# EAGLE design cropdroid-irrigation (EAGLE 9.7.0)
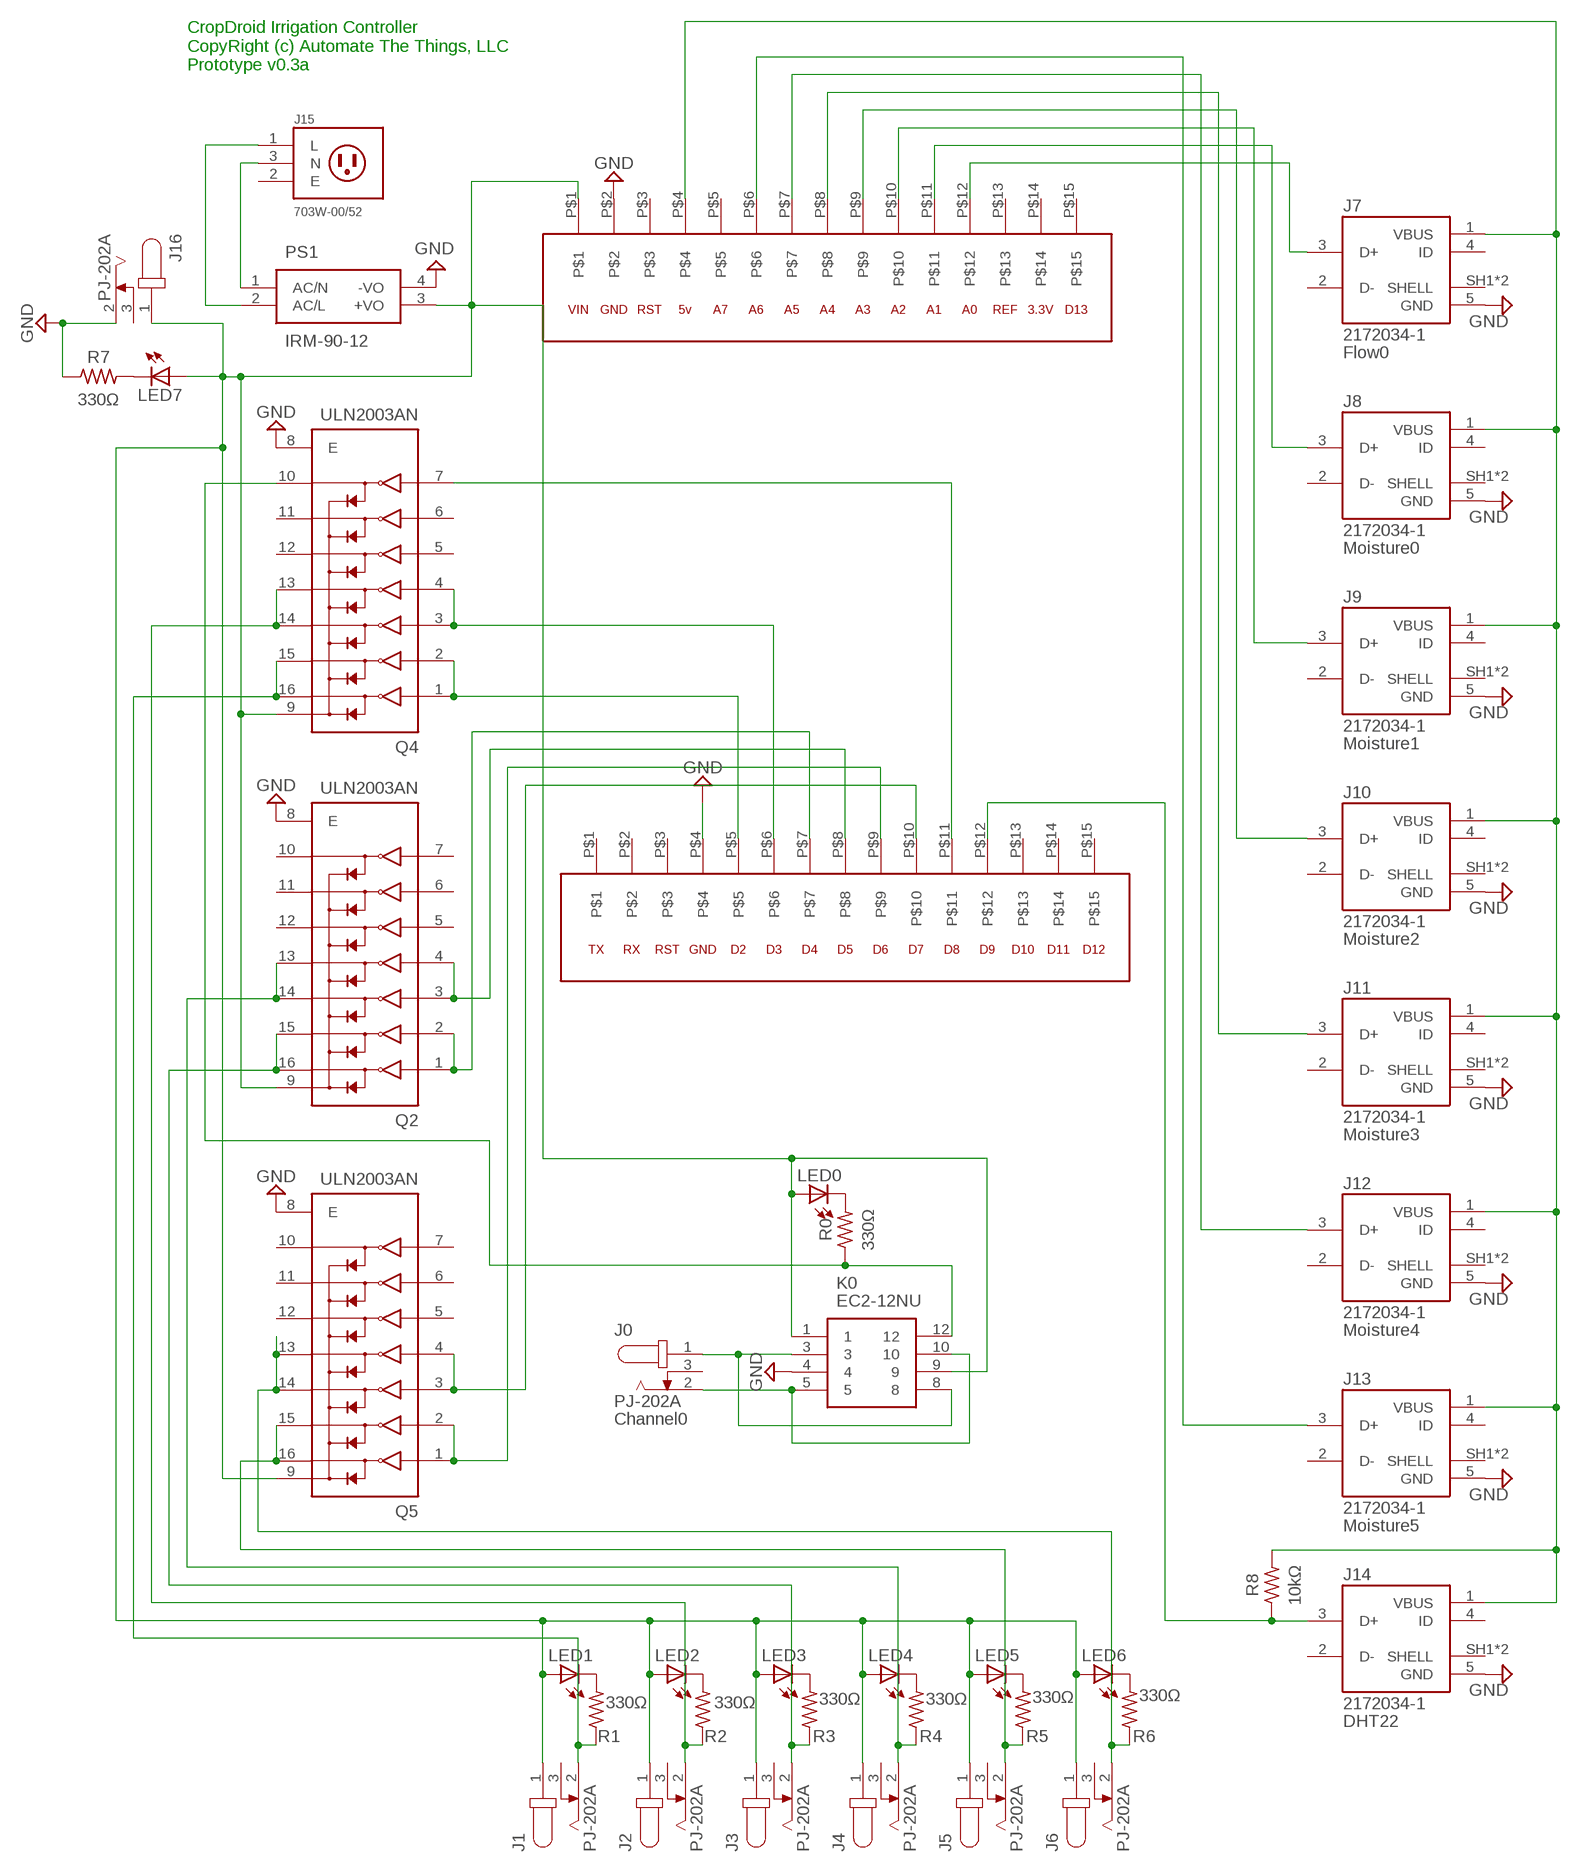
[diagram p0: schematic, sheet 1]

## Parts
J0  PJ-202A  [CUI_PJ-202A]
J1  PJ-202A  [CUI_PJ-202A]
J2  PJ-202A  [CUI_PJ-202A]
J3  PJ-202A  [CUI_PJ-202A]
J4  PJ-202A  [CUI_PJ-202A]
J5  PJ-202A  [CUI_PJ-202A]
J6  PJ-202A  [CUI_PJ-202A]
J7  2172034-1  [TE_2172034-1]
J8  2172034-1  [TE_2172034-1]
J9  2172034-1  [TE_2172034-1]
J10  2172034-1  [TE_2172034-1]
J11  2172034-1  [TE_2172034-1]
J12  2172034-1  [TE_2172034-1]
J13  2172034-1  [TE_2172034-1]
J14  2172034-1  [TE_2172034-1]
J15  703W-00/52  [QUALTEK_703W-00/52]
J16  PJ-202A  [CUI_PJ-202A]
K0  EC2-12NU  [EC2-12NU]
LED0  LED3MM  [LED3MM]
LED1  LED3MM  [LED3MM]
LED2  LED3MM  [LED3MM]
LED3  LED3MM  [LED3MM]
LED4  LED3MM  [LED3MM]
LED5  LED3MM  [LED3MM]
LED6  LED3MM  [LED3MM]
LED7  LED3MM  [LED3MM]
PS1  IRM-90-12  [IRM9012]
Q2  ULN2003AN  [DIP794W45P254L1969H508Q16]
Q4  ULN2003AN  [DIP794W45P254L1969H508Q16]
Q5  ULN2003AN  [DIP794W45P254L1969H508Q16]
R0  330Ω  R-US_AXIAL-7.2MM-PITCH  [RESAD724W46L381D178B]
R1  330Ω  R-US_AXIAL-7.2MM-PITCH  [RESAD724W46L381D178B]
R2  330Ω  R-US_AXIAL-7.2MM-PITCH  [RESAD724W46L381D178B]
R3  330Ω  R-US_AXIAL-7.2MM-PITCH  [RESAD724W46L381D178B]
R4  330Ω  R-US_AXIAL-7.2MM-PITCH  [RESAD724W46L381D178B]
R5  330Ω  R-US_AXIAL-7.2MM-PITCH  [RESAD724W46L381D178B]
R6  330Ω  R-US_AXIAL-7.2MM-PITCH  [RESAD724W46L381D178B]
R7  330Ω  R-US_AXIAL-7.2MM-PITCH  [RESAD724W46L381D178B]
R8  10kΩ  R-US_AXIAL-7.2MM-PITCH  [RESAD724W46L381D178B]
U$1  PPTC151LFBN-RC  [PPTC151LFBN-RC]
U$2  PPTC151LFBN-RC  [PPTC151LFBN-RC]

## Nets
GND: J7.5(GND) J8.5(GND) J9.5(GND) J10.5(GND) J11.5(GND) J12.5(GND) J13.5(GND) J14.5(GND) J16.2 K0.4 PS1.4(-VO) Q2.8(E) Q4.8(E) Q5.8(E) R7.1 U$1.P$2 U$2.P$4
N$1: J13.3(D+) U$1.P$6
N$2: K0.12 Q4.10(7C) R0.1
N$3: Q4.1(1B) Q4.2(2B) U$2.P$5
N$4: Q4.3(3B) Q4.4(4B) U$2.P$6
N$5: Q2.1(1B) Q2.2(2B) U$2.P$7
N$6: Q2.3(3B) Q2.4(4B) U$2.P$8
N$7: Q5.1(1B) Q5.2(2B) U$2.P$9
N$8 [PowerSupply]: J1.1 J2.1 J3.1 J4.1 J5.1 J6.1 J16.1 K0.1 K0.9 LED0.A LED1.A LED2.A LED3.A LED4.A LED5.A LED6.A LED7.A PS1.3(+VO) Q2.9(COM) Q4.9(COM) Q5.9(COM) U$1.P$1
N$9: Q4.7(7B) U$2.P$11
N$10: J7.1(VBUS) J8.1(VBUS) J9.1(VBUS) J10.1(VBUS) J11.1(VBUS) J12.1(VBUS) J13.1(VBUS) J14.1(VBUS) R8.2 U$1.P$4
N$11: LED7.K(C) R7.2
N$12: J14.3(D+) R8.1 U$2.P$12
N$13: J0.1 K0.3 K0.8
N$14: J8.3(D+) U$1.P$11
N$15: J0.2 K0.5 K0.10
N$16: J9.3(D+) U$1.P$10
N$17: J10.3(D+) U$1.P$9
N$18: J11.3(D+) U$1.P$8
N$19: J12.3(D+) U$1.P$7
N$20: Q5.3(3B) Q5.4(4B) U$2.P$10
N$21: J7.3(D+) U$1.P$12
N$23 [PowerSupply]: J15.1(L) PS1.2(AC/L)
N$24: LED1.K(C) R1.2
N$25: LED2.K(C) R2.2
N$26 [PowerSupply]: J15.3(N) PS1.1(AC/N)
N$28: LED3.K(C) R3.2
N$37: J1.2 Q4.15(2C) Q4.16(1C) R1.1
N$41: LED4.K(C) R4.2
N$42: LED0.K(C) R0.2
N$45: LED5.K(C) R5.2
N$46: LED6.K(C) R6.2
N$48: J2.2 Q4.13(4C) Q4.14(3C) R2.1
N$51: J3.2 Q2.15(2C) Q2.16(1C) R3.1
N$52: J4.2 Q2.13(4C) Q2.14(3C) R4.1
N$55: J5.2 Q5.15(2C) Q5.16(1C) R5.1
N$56: J6.2 Q5.13(4C) Q5.14(3C) R6.1
Unconnected: J0.3 J1.3 J2.3 J3.3 J4.3 J5.3 J6.3 J7.2(D-) J7.4(ID) J8.2(D-) J8.4(ID) J9.2(D-) J9.4(ID) J10.2(D-) J10.4(ID) J11.2(D-) J11.4(ID) J12.2(D-) J12.4(ID) J13.2(D-) J13.4(ID) J14.2(D-) J14.4(ID) J16.3 Q2.5(5B) Q2.6(6B) Q2.7(7B) Q2.10(7C) Q2.11(6C) Q2.12(5C) Q4.5(5B) Q4.6(6B) Q4.11(6C) Q4.12(5C) Q5.5(5B) Q5.6(6B) Q5.7(7B) Q5.10(7C) Q5.11(6C) Q5.12(5C) U$1.P$3 U$1.P$5 U$1.P$13 U$1.P$14 U$1.P$15 U$2.P$1 U$2.P$2 U$2.P$3 U$2.P$13 U$2.P$14 U$2.P$15

## Notes on the sheet
- CropDroid Irrigation Controller
  CopyRight (c) Automate The Things, LLC
  Prototype v0.3a
- VIN | GND | RST | 5v | A7 | A6 | A5 | A4 | A3 | A2 | A1 | A0 | REF | 3.3V | D13
- Flow0
- Moisture0
- Moisture1
- TX | RX | RST | GND | D2 | D3 | D4 | D5 | D6 | D7 | D8 | D9 | D10 | D11 | D12 | Moisture2
- Moisture3
- Moisture4
- Channel0
- Moisture5
- DHT22

## Power pins joined to a net without a drawn wire
E: J15.2(E)
SHELL: J7.SH1(SHELL) J7.SH2(SHELL) J8.SH1(SHELL) J8.SH2(SHELL) J9.SH1(SHELL) J9.SH2(SHELL) J10.SH1(SHELL) J10.SH2(SHELL) J11.SH1(SHELL) J11.SH2(SHELL) J12.SH1(SHELL) J12.SH2(SHELL) J13.SH1(SHELL) J13.SH2(SHELL) J14.SH1(SHELL) J14.SH2(SHELL)

## Library data of the parts
J0 J1-J6 J16 = PJ-202A:PJ-202A: 2.0 mm Center Pin, 2.5 A, Right Angle, Through Hole, Kinked Pins, Dc Power Jack Connector Check prices <https://pricing.snapeda.com/parts/PJ-202A/CUI%20Devices/view-part?ref=eda>; AVAILABILITY: In Stock; CUI_PURCHASE_URL: https://www.cuidevices.com/product/interconnect/connectors/dc-power-connectors/jacks/pj-202a?utm_source=snapeda.com&utm_medium=referral&utm_campaign=snapedaBOM; DESCRIPTION: 2.0 x 6.5 mm, 2.5 A, Horizontal, Through Hole, Kinked Pins, Dc Power Jack Connector; MF: CUI Devices; MP: PJ-202A; PACKAGE: None; PRICE: None
J7-J14 = 2172034-1:2172034-1: CONN RCPT USB MINI B 2.0 PCB R/A Check prices <https://pricing.snapeda.com/parts/2172034-1/TE%20Connectivity/view-part?ref=eda>; AVAILABILITY: In Stock; COMMENT: 2172034-1; DESCRIPTION: Conn Mini USB Type B RCP 5 POS 0.8mm Solder RA Thru-Hole 5 Terminal 1 Port Box/Tray; EU_ROHS_COMPLIANCE: Compliant; MF: TE Connectivity; MP: 2172034-1; PACKAGE: None; PRICE: None; PURCHASE-URL: https://pricing.snapeda.com/search/part/2172034-1/?ref=eda
J15 = 703W-00_52:703W-00/52: 3 Position 250 V 10 A Male Pins AC Receptacle Right Angle Connector Check prices <https://pricing.snapeda.com/parts/703W-00/52/Qualtek/view-part?ref=eda>; AVAILABILITY: In Stock; DESCRIPTION: Power Entry Connector Receptacle, Male Blades IEC 320-C14 Panel Mount, Flange; Through Hole, Right Angle; MF: Qualtek; MP: 703W-00/52; PACKAGE: None; PRICE: None
K0 = EC2-12NU:EC2-12NU: DPDT PCB Mount Non-Latching Relay 2 A, 12V dc Source: Datasheet; DESCRIPTION: DPDT PCB Mount Non-Latching Relay 2 A, 12V dc; HEIGHT: mm; MANUFACTURER_NAME: Kemet; MANUFACTURER_PART_NUMBER: EC2-12NU; MOUSER_PART_NUMBER: 80-EC2-12NU; MOUSER_PRICE-STOCK: https://www.mouser.co.uk/ProductDetail/KEMET/EC2-12NU?qs=BenOyfdfArqRFl%252BOm5Bdvw%3D%3D
LED0 LED1-LED7 = adafruit:LED: LED OSRAM: - CHIPLED LG R971, LG N971, LY N971, LG Q971, LY Q971, LO R971, LY R971 LH N974, LH R974 LS Q976, LO Q976, LY Q976 LO Q996 - Hyper CHIPLED LW Q18S LB Q993, LB Q99A, LB R99A - SideLED LS A670, LO A670, LY A670, LG A670, LP A670 LB A673, LV A673, LT A673, LW A673 LH A674 LY A675 LS A676, LA A676, LO A676, LY A676, LW A676 LS A679, LY A679, LG A679 - Hyper Micro SIDELED® LS Y876, LA Y876, LO Y876, LY Y876 LT Y87S - SmartLED LW L88C, LW L88S LB L89C, LB L89S, LG L890 LS L89K, LO L89K, LY L89K LS L896, LA L896, LO L896, LY L896 - TOPLED LS T670, LO T670, LY T670, LG T670, LP T670 LSG T670, LSP T670, LSY T670, LOP T670, LYG T670 LG T671, LOG T671, LSG T671 LB T673, LV T673, LT T673, LW T673 LH T674 LS T676, LA T676, LO T676, LY T676, LB T676, LH T676, LSB T676, LW T676 LB T67C, LV T67C, LT T67C, LS T67K, LO T67K, LY T67K, LW E67C LS E67B, LA E67B, LO E67B, LY E67B, LB E67C, LV E67C, LT E67C LW T67C LS T679, LY T679, LG T679 LS T770, LO T770, LY T770, LG T770, LP T770 LB T773, LV T773, LT T773, LW T773 LH T774 LS E675, LA E675, LY E675, LS T675 LS T776, LA T776, LO T776, LY T776, LB T776 LHGB T686 LT T68C, LB T68C - Hyper Mini TOPLED® LB M676 - Mini TOPLED Santana® LG M470 LS M47K, LO M47K, LY M47K Source: http://www.osram.convergy.de/
PS1 = IRM-90-12:IRM-90-12: AC/DC Power Supply Single-OUT 12V 7.37A 88.4W 4-Pin Carton Source: Datasheet <https://www.meanwell.com/webapp/product/search.aspx?prod=IRM-90>; ARROW_PART_NUMBER: IRM-90-12; ARROW_PRICE-STOCK: https://www.arrow.com/en/products/irm-90-12/mean-well-enterprises; DESCRIPTION: AC/DC Power Supply Single-OUT 12V 7.37A 88.4W 4-Pin Carton; HEIGHT: 29.5mm; MANUFACTURER_NAME: Mean Well; MANUFACTURER_PART_NUMBER: IRM-90-12; MOUSER_PART_NUMBER: 709-IRM-90-12; MOUSER_PRICE-STOCK: https://www.mouser.co.uk/ProductDetail/MEAN-WELL/IRM-90-12?qs=GBLSl2AkirunioXt9%2Fsnzw%3D%3D
Q2 Q4 Q5 = ULN2003AN:ULN2003AN: Check prices <https://pricing.snapeda.com/parts/ULN2003AN/Texas%20Instruments/view-part?ref=eda>; AVAILABILITY: In Stock; DESCRIPTION: 50-V, 7-ch darlington transistor array, -20C to 70C 16-PDIP -40 to 70; MF: Texas Instruments; MP: ULN2003AN; PACKAGE: PDIP-16 Texas Instruments; PRICE: None; PURCHASE-URL: https://pricing.snapeda.com/search/part/ULN2003AN/?ref=eda
R0 R1-R8 = Resistor:R-US: Resistor Fixed - ANSI; CATEGORY: Resistor; SUB-CATEGORY: Fixed
U$1 U$2 = PPTC151LFBN-RC:PPTC151LFBN-RC: Check prices <https://pricing.snapeda.com/parts/PPTC151LFBN-RC/Sullins%20Connector/view-part?ref=eda>; AVAILABILITY: In Stock; DESCRIPTION: 15 Position Header Connector 0.100 (2.54mm) Through Hole Tin; MF: Sullins Connector; MP: PPTC151LFBN-RC; PACKAGE: None; PRICE: None

## Net classes
0 default: width 0.254 mm, drill 0.381 mm, clearance 0.254 mm
1 MainsAC: width 6.299 mm, drill 0.381 mm, clearance 0.6 mm
2 PowerSupply: width 0.711 mm, drill 0.381 mm, clearance 0.254 mm

## Board
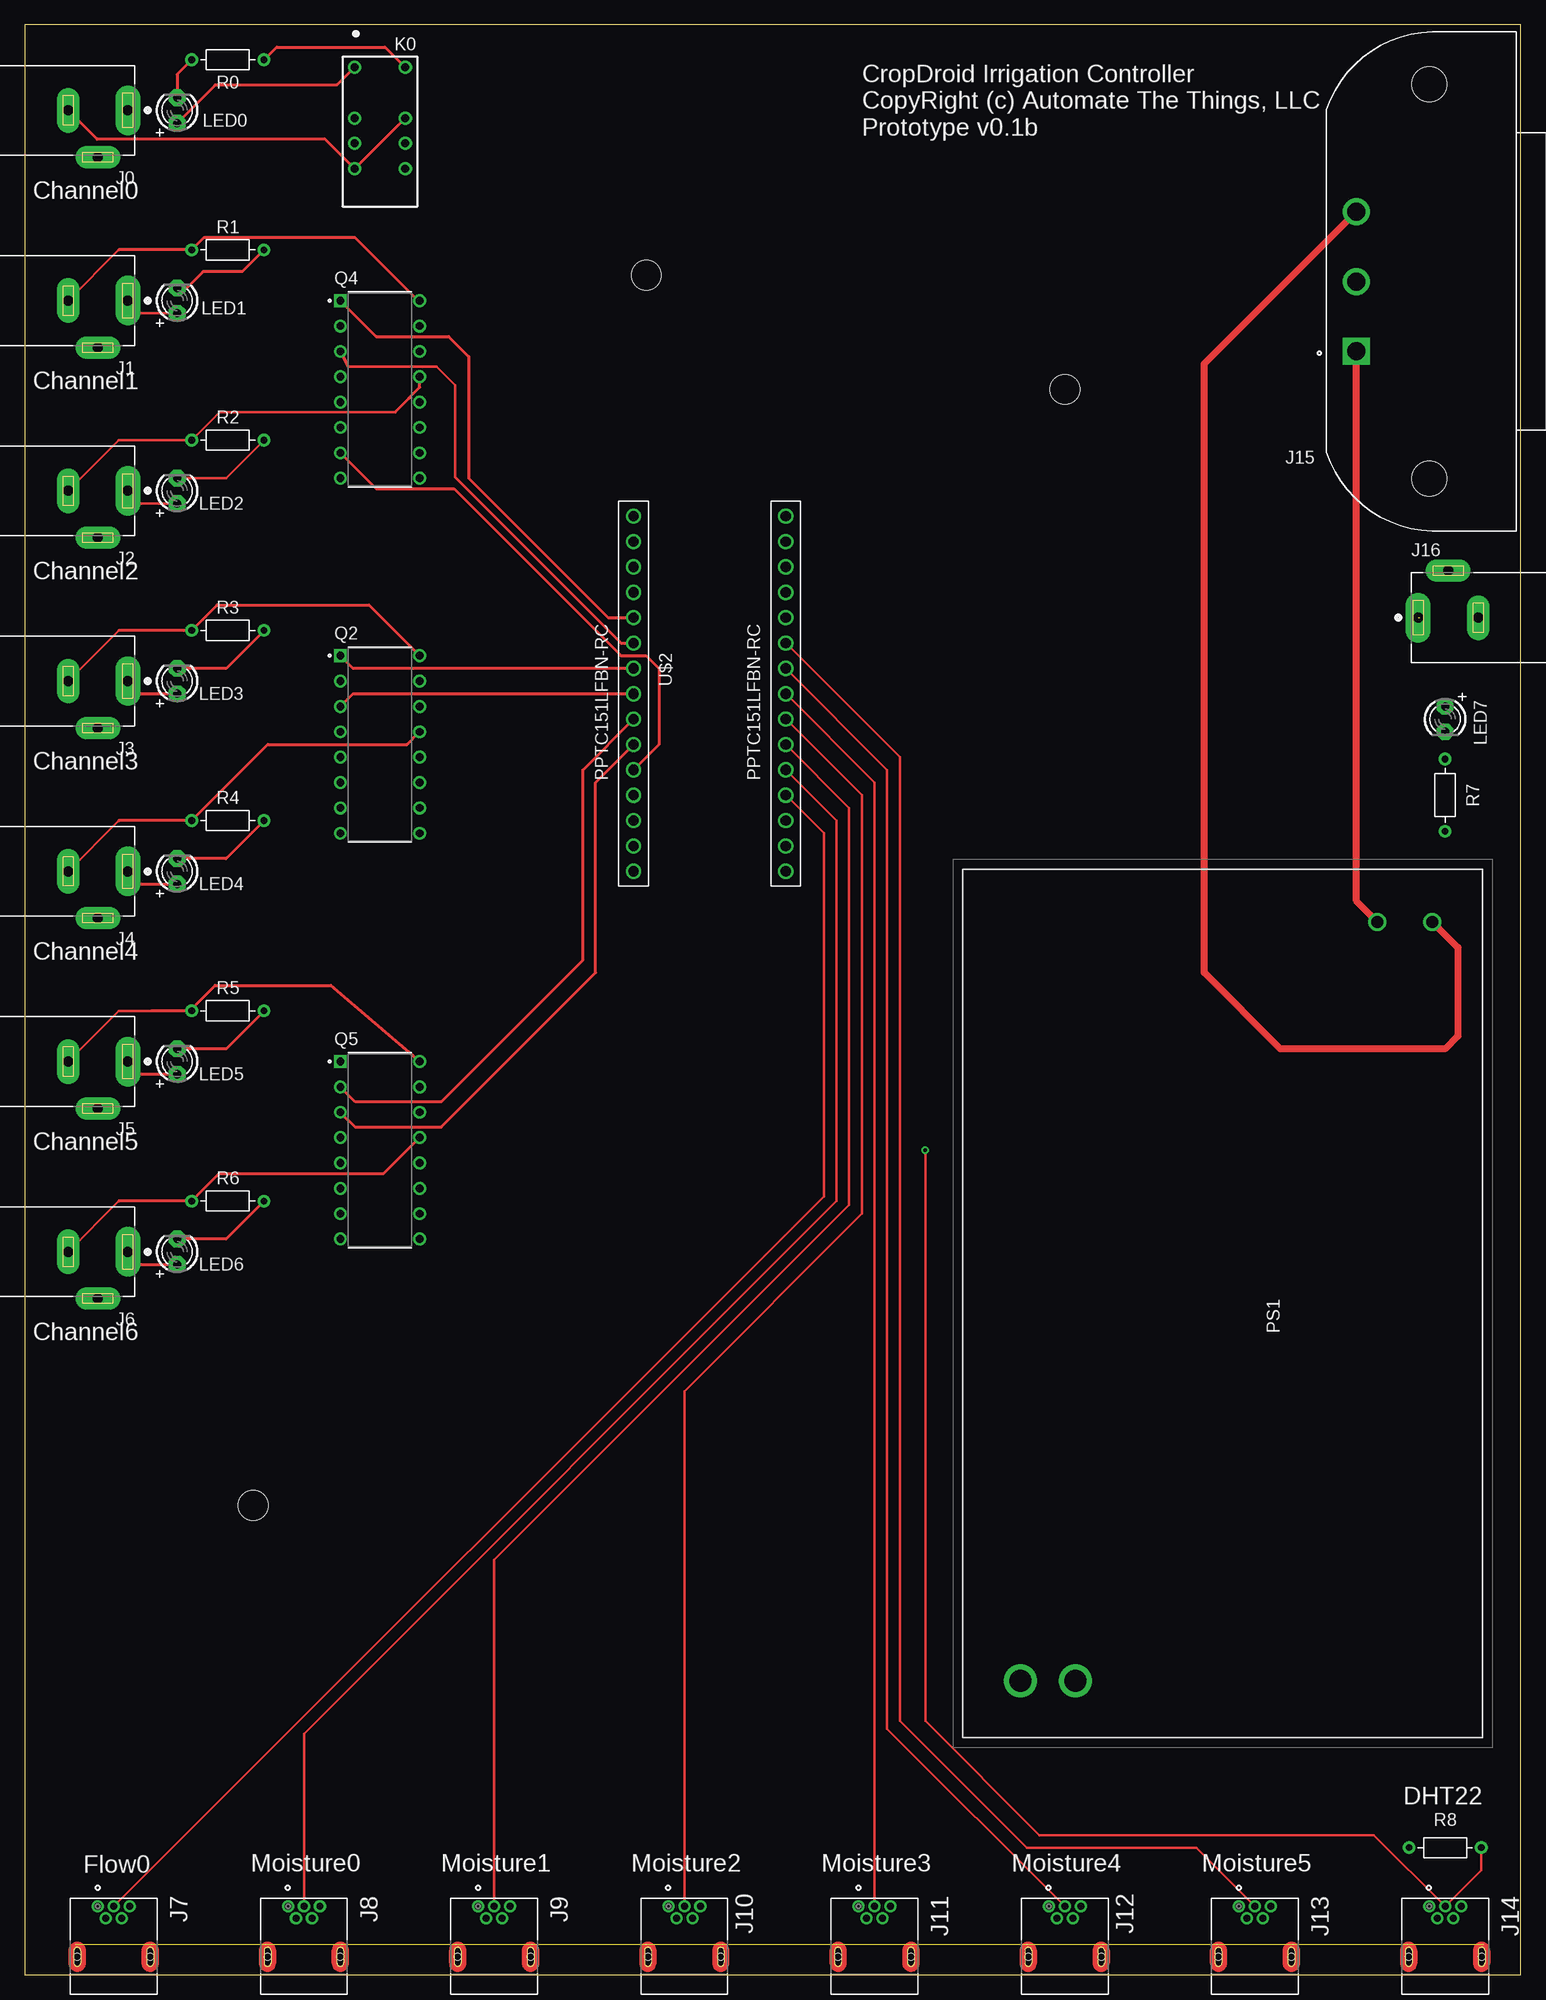
[diagram p1: board, top side]
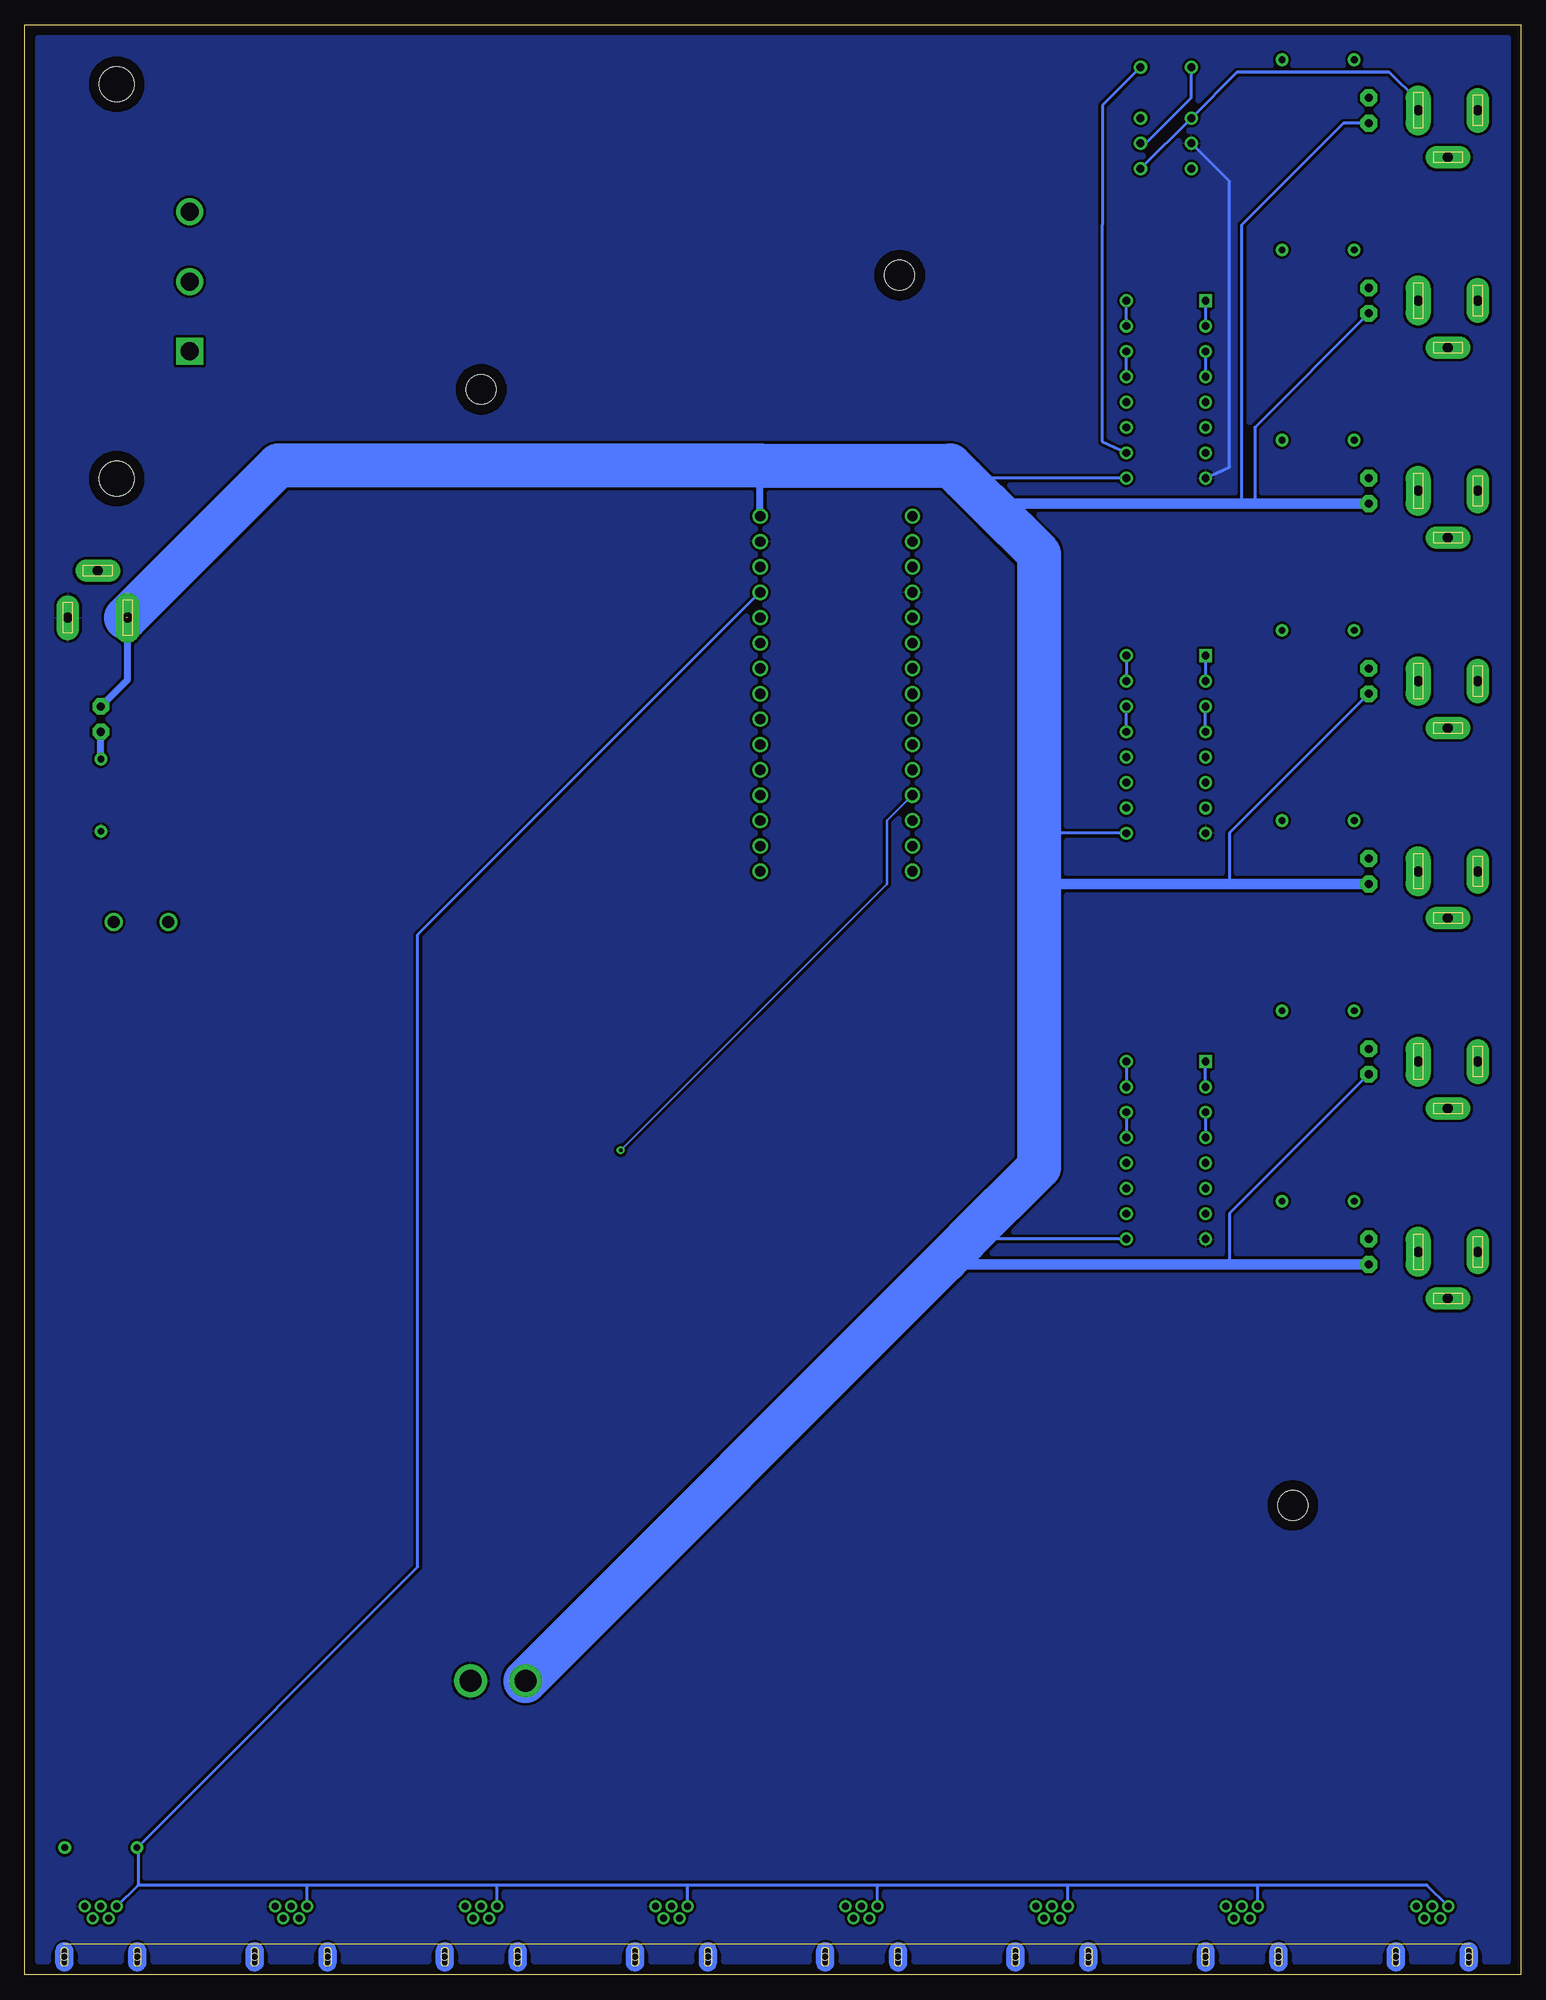
[diagram p2: board, bottom side, seen from below]

Size 149.84 x 195.25 mm. Coordinates in mm from the lower left corner, seen from the top.
Outline: 0,0 149.84,0 149.84,195.25 0,195.25 0,0
Copper layers (1*16): Top / Bottom
Stack-up Default Layer Stack: Top User Defined 0.035mm / Dielectric-1 User Defined 1.5mm / Bottom User Defined 0.035mm
Design rules: minimum copper width class=1 248mil, minimum copper width class=2 28mil, minimum copper width class=0 10mil, minimum copper width 10mil, minimum drill size class=1 15mil, minimum drill size class=2 15mil, minimum drill size class=0 15mil, minimum drill size 0.35mm, copper clearance class=1 to class=1 0.6mm, copper clearance class=2 to class=2 10mil, copper clearance class=0 to class=0 10mil, copper clearance wire_polygon to wire_polygon 10mil, copper clearance wire_polygon to pad_smd 10mil, copper clearance wire_polygon to via 10mil, copper clearance pad_smd to pad_smd 10mil, copper clearance pad_smd to via 10mil, copper clearance via to via 10mil, copper clearance smd to pad (same net) 6mil, copper clearance smd to via (same net) 6mil, copper clearance smd to smd (same net) 6mil, dimension clearance 40mil, via restrict clearance 0mil, restrict clearance 0mil, drill distance 6mil, keepout clearance 0mil
Holes 3 mm at 22.86,46.99 62.23,170.18 104.14,158.75

### Footprints (pad centres in the part's own frame; a part is rotated, then mirrored left to right if it is on the bottom)
CUI_PJ-202A = drill 1 pad 2.5 long: 1 -6.5,0 | drill 1 pad 2.25 long: 2 -0.5,0; 3 -3.5,4.7
TE_2172034-1 = drill 0.7: 1 -5.05,-1.6; 2 -3.85,-0.8; 3 -5.05,0; 4 -3.85,0.8; 5 -5.05,1.6 | smd 0.1 x 0.1: SH1 -1.27,3.81; SH2 -1.27,-3.81 | hole 0.7: 0,3.65; 0,-3.65
QUALTEK_703W-00/52 = drill 1.8 square: 1 0,0 | drill 1.8: 2 7,0; 3 14,0 | hole 3.5: 26.75,-7.3; -12.75,-7.3
EC2-12NU = drill 0.8 pad 1.3: 1 1.05,-2.54; 3 6.13,-2.54; 4 8.67,-2.54; 5 11.21,-2.54; 8 11.21,2.54; 9 8.67,2.54; 10 6.13,2.54; 12 1.05,2.54
LED3MM = drill 0.813 pad 1.676 octagon: A -1.27,0; K 1.27,0
IRM9012 = drill 1.2 pad 1.8: 1 0,0; 2 0,-5.5 | drill 2.2 pad 3.3: 3 76,-41.25; 4 76,-35.75
DIP794W45P254L1969H508Q16 = drill 0.78 pad 1.13 square: 1 -3.97,8.89 | drill 0.78 pad 1.13: 2 -3.97,6.35; 3 -3.97,3.81; 4 -3.97,1.27; 5 -3.97,-1.27; 6 -3.97,-3.81; 7 -3.97,-6.35; 8 -3.97,-8.89; 9 3.97,-8.89; 10 3.97,-6.35; 11 3.97,-3.81; 12 3.97,-1.27; 13 3.97,1.27; 14 3.97,3.81; 15 3.97,6.35; 16 3.97,8.89
RESAD724W46L381D178B = drill 0.66 pad 1.26: 1 -3.62,0; 2 3.62,0
PPTC151LFBN-RC = drill 1.02: P$1 0,0; P$2 2.54,0; P$3 5.08,0; P$4 7.62,0; P$5 10.16,0; P$6 12.7,0; P$7 15.24,0; P$8 17.78,0; P$9 20.32,0; P$10 22.86,0; P$11 25.4,0; P$12 27.94,0; P$13 30.48,0; P$14 33.02,0; P$15 35.56,0

### Placement (x,y rotation side)
J0  3.81,186.69 180 top
J1  3.81,167.64 180 top
J2  3.81,148.59 180 top
J3  3.81,129.54 180 top
J4  3.81,110.49 180 top
J5  3.81,91.44 180 top
J6  3.81,72.39 180 top
J7  8.89,1.78 270 top
J8  27.94,1.78 270 top
J9  46.99,1.78 270 top
J10  66.04,1.78 270 top
J11  85.09,1.78 270 top
J12  104.14,1.78 270 top
J13  123.19,1.78 270 top
J14  142.24,1.78 270 top
J15  133.35,162.56 90 top
J16  146.05,135.89 0 top
K0  35.56,192.06 270 top
LED0  15.24,186.69 90 top
LED1  15.24,167.64 90 top
LED2  15.24,148.59 90 top
LED3  15.24,129.54 90 top
LED4  15.24,110.49 90 top
LED5  15.24,91.44 90 top
LED6  15.24,72.39 90 top
LED7  142.24,125.73 270 top
PS1  140.97,105.41 270 top
Q2  35.56,123.19 0 top
Q4  35.56,158.75 0 top
Q5  35.56,82.55 0 top
R0  20.32,191.77 180 top
R1  20.32,172.72 0 top
R2  20.32,153.67 0 top
R3  20.32,134.62 0 top
R4  20.32,115.57 0 top
R5  20.32,96.52 0 top
R6  20.32,77.47 0 top
R7  142.24,118.11 90 top
R8  142.24,12.7 180 top
U$1  76.2,146.05 270 top
U$2  60.96,146.05 270 top

### Tracks (layer width: path | path; a pad name or v marks a point on that pad's centre or on a via)
GND
  Bottom 0.305: K0.4 29.21,179.58 29.21,150.97 Q4.8
  pour Bottom: 0,195.25 0,0 151.11,0 151.11,195.25
N$1
  Top 0.254: J13.3 117.32,12.7 100.33,12.7 87.63,25.4 87.63,121.92 U$1.P$6
N$2
  Top 0.305: R0.1 25.21,193.04 36.07,193.04 K0.12
  Bottom 0.305: K0.12 41.91,187.2 41.91,175.26 41.91,153.51 Q4.10
N$3
  Top 0.305: Q4.1 35.18,164.05 42.44,164.05 44.45,162.04 44.45,149.86 58.42,135.89 U$2.P$5
  Bottom 0.305: Q4.1 Q4.2
N$4
  Top 0.254: 32.35,161.04 41.22,161.04 43.09,159.18 43.09,149.94
  Top 0.305: Q4.3 32.35,161.04 | 43.09,149.94 59.69,133.35 U$2.P$6
  Bottom 0.305: Q4.3 Q4.4
N$5
  Top 0.305: U$2.P$7 32.86,130.81 Q2.1
  Bottom 0.305: Q2.1 Q2.2
N$6
  Top 0.305: Q2.3 32.86,128.27 U$2.P$8
  Bottom 0.305: Q2.4 Q2.3
N$7
  Top 0.305: Q5.2 33.08,87.41 41.69,87.41 55.88,101.6 55.88,120.65 U$2.P$9
  Bottom 0.305: Q5.2 Q5.1
N$8  (1 unrouted)
  Top 0.254: 11.58,147.32 LED2.A | LED1.A 11.58,166.37
  Top 0.305: LED3.A 11.58,128.27 J3.1 | LED4.A 11.58,109.22 J4.1 | LED5.A 11.58,90.17 J5.1 | LED6.A 11.58,71.12 J6.1 | 11.58,166.37 J1.1 | J2.1 11.58,147.32 | LED0.A 19.05,189.23 31.24,189.23 K0.1
  Bottom 0.305: LED5.A 29.21,76.2 29.21,71.12 | LED3.A 29.21,114.3 29.21,109.22 | LED1.A 26.67,154.94 26.67,147.32 | Q5.9 55.47,73.66 | Q4.9 55.88,149.86 | Q2.9 48.26,114.3 | K0.1 33.02,187.96 37.59,183.39 K0.9 | LED0.A 17.78,185.42 27.94,175.26 27.94,147.32
  Bottom 0.711: U$1.P$1 76.2,151.13 | LED7.A 139.55,129.69 J16.1
  Bottom 1.067: LED4.A 29.21,109.22 48.26,109.22 | LED6.A 29.21,71.12 57.15,71.12 57.58,71.55 | 55.47,73.66 55.67,73.45 | LED2.A 26.67,147.32 27.94,147.32 53.34,147.32
  Bottom 4.394: PS1.3 57.58,71.55 55.67,73.45 48.26,80.87 48.26,109.22 48.26,114.3 48.26,142.24 53.34,147.32 55.88,149.86 57.15,151.13 76.2,151.13 124.46,151.13 139.7,135.89
N$9
  Top 0.305: Q4.7 35.18,148.81 42.96,148.81 59.69,132.08 62.23,132.08 63.5,130.81 63.5,123.19 U$2.P$11
N$10
  Bottom 0.305: J7.1 9.43,8.96 26.29,8.96 | 26.29,8.96 45.34,8.96 | 45.34,8.96 64.52,8.96 | 64.52,8.96 83.44,8.96 | 83.44,8.96 102.49,8.96 | 102.49,8.96 121.54,8.96 | 121.54,8.96 138.5,8.96 | J8.1 26.34,8.91 26.29,8.96 | J9.1 45.39,8.91 45.34,8.96 | J10.1 64.44,8.89 64.52,8.96 | J11.1 83.49,8.91 83.44,8.96 | J12.1 102.54,8.91 102.49,8.96 | J13.1 121.59,8.91 121.54,8.96 | J14.1 138.5,8.96 | 138.5,8.96 138.5,12.58 R8.2 110.49,40.83 110.49,104.14 U$1.P$4
N$11
  Bottom 0.711: R7.2 LED7.K
N$12  (via drill 0.38)
  Top 0.254: R8.1 145.86,10.45 J14.3 135.1,13.97 101.6,13.97 90.17,25.4 v90.17,82.55
  Bottom 0.254: v90.17,82.55 63.5,109.22 63.5,115.57 U$2.P$12
N$13
  Bottom 0.305: K0.8 K0.3 28.45,190.5 13.17,190.5 10.31,187.64 J0.1
N$14
  Top 0.254: J8.3 27.94,24.13 81.28,77.47 81.28,115.57 U$1.P$11
N$15
  Top 0.305: K0.10 K0.5 30.09,183.78 7.22,183.78 J0.2
N$16
  Top 0.254: J9.3 46.99,41.53 82.55,77.09 82.55,116.84 U$1.P$10
N$17
  Top 0.254: U$1.P$9 83.82,118.11 83.82,76.2 66.04,58.42 J10.3
N$18
  Top 0.254: J11.3 85.09,119.38 U$1.P$8
N$19
  Top 0.254: J12.3 86.36,24.61 86.36,120.65 U$1.P$7
N$20
  Top 0.305: Q5.3 33.08,84.87 41.69,84.87 57.15,100.33 57.15,119.38 U$2.P$10
  Bottom 0.305: Q5.3 Q5.4
N$21
  Top 0.254: J7.3 80.01,77.95 80.01,114.3 U$1.P$12
N$23
  Top 0.711: PS1.2 133.35,107.53 J15.1
N$24
  Top 0.305: LED1.K 16.21,168.91 17.85,170.55 21.77,170.55 R1.2
N$25
  Top 0.254: R2.2 20.13,149.86 LED2.K
N$26
  Top 0.711: PS1.1 143.51,102.87 143.51,93.98 142.24,92.71 125.73,92.71 118.11,100.33 118.11,161.32 J15.3
N$28
  Top 0.305: R3.2 20.13,130.81 LED3.K
N$37
  Top 0.254: 9.39,172.72 J1.2
  Top 0.305: 9.39,172.72 R1.1 17.97,173.99 33.02,173.99 39.51,167.5 Q4.16
  Bottom 0.305: Q4.15 Q4.16
N$41
  Top 0.305: R4.2 20.13,111.76 LED4.K
N$42
  Top 0.305: R0.2 15.24,190.31 LED0.K
N$45
  Top 0.305: R5.2 20.13,92.71 LED5.K
N$46
  Top 0.305: R6.2 20.13,73.66 LED6.K
N$48
  Top 0.254: J2.2 9.39,153.67 R2.1 19.48,156.46 37.08,156.46
  Top 0.305: 37.08,156.46 38.48,157.86 38.48,157.91 39.53,158.97 Q4.13
  Bottom 0.305: Q4.13 Q4.14
N$51
  Top 0.254: 9.39,134.62 J3.2
  Top 0.305: 9.39,134.62 R3.1 19.24,137.16 34.45,137.16 Q2.16
  Bottom 0.305: Q2.16 Q2.15
N$52
  Top 0.254: 9.39,115.57 J4.2
  Top 0.305: 9.39,115.57 R4.1 24.32,123.19 38.26,123.19 Q2.13
  Bottom 0.305: Q2.13 Q2.14
N$55
  Top 0.254: 12.63,96.52 9.39,96.52 J5.2
  Top 0.305: 16.51,96.52 R5.1 | 16.51,96.52 19.05,99.06 30.64,99.06 Q5.16 | 16.51,96.52 12.63,96.52
  Bottom 0.305: Q5.16 Q5.15
N$56
  Top 0.254: 9.39,77.47 J6.2
  Top 0.305: 9.39,77.47 R6.1 19.46,80.23 35.94,80.23 Q5.13
  Bottom 0.305: Q5.14 Q5.13
SHELL  (15 unrouted)

### Text on the board
tPlace: CropDroid Irrigation Controller / CopyRight (c) Automate The Things, LLC / Prototype v0.1b | Channel0 | Channel1 | Channel2 | Channel3 | Channel4 | Channel5 | Channel6 | DHT22 | Flow0 | Moisture0 | Moisture1 | Moisture2 | Moisture3 | Moisture4 | Moisture5